# Altium schematic sheet Voltage_Reg_12V.SchDoc: =SheetTitle
size B; SheetTitle: 12V Buck-Boost Reg.; DrawnBy: Samyar Sadat Akhavi; DocumentNumber: 12; SheetNumber: 12; SheetTotal: 19
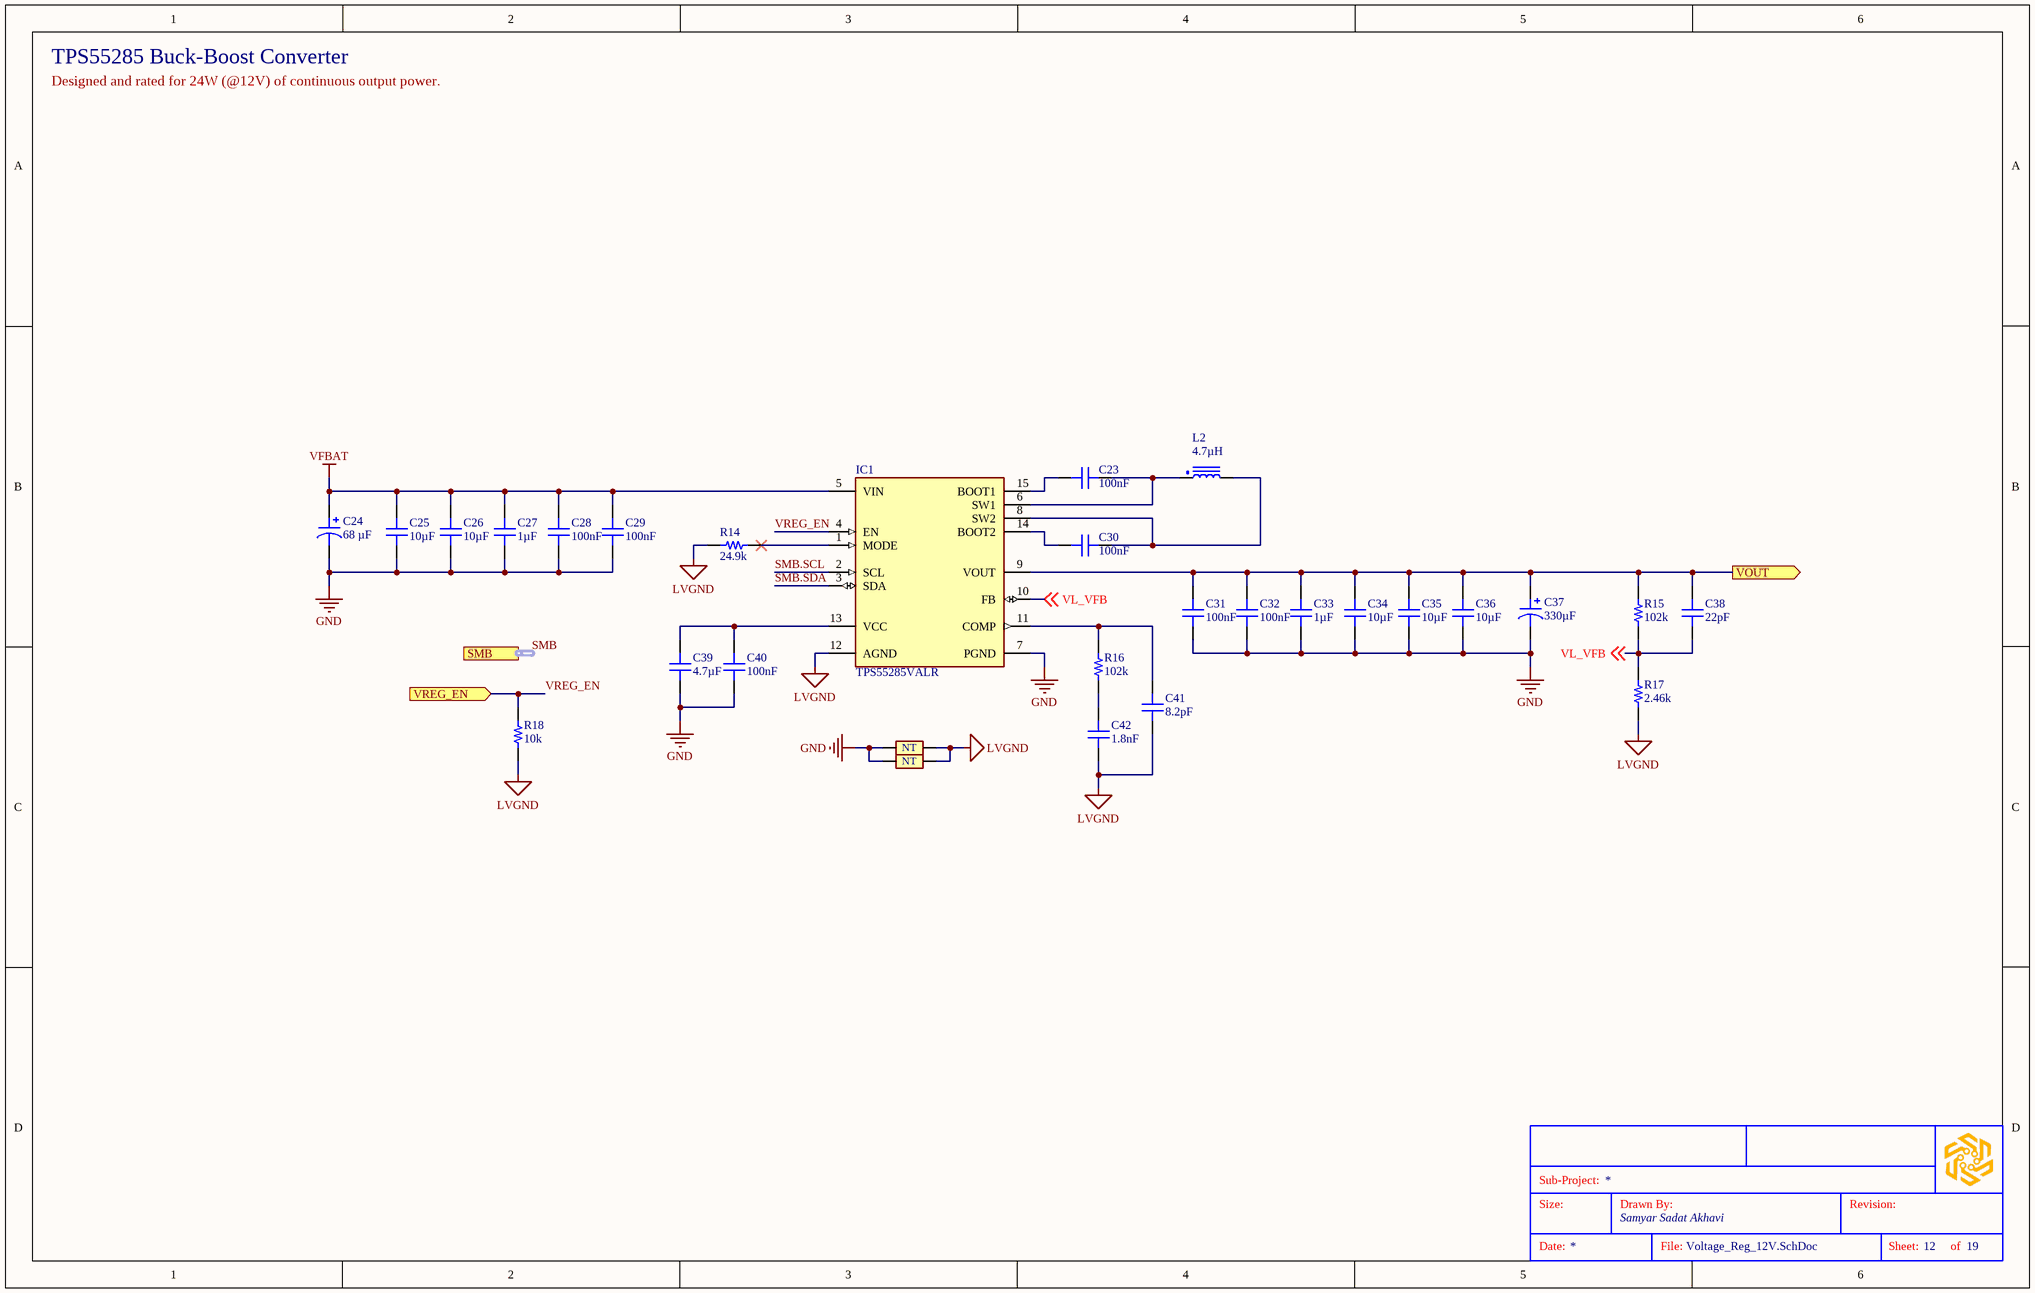
[diagram p0: Voltage_Reg_12V.SchDoc]

## Parts
?  (no value)  (graphical)
C23  100nF  [CAP 0603_1608]
C24  68 µF  [CAP ALSMD 6.6MM H7.7MM]
C25  10µF  [CAP 1206_3216]
C26  10µF  [CAP 1206_3216]
C27  1µF  [CAP 0603_1608]
C28  100nF  [CAP 0603_1608]
C29  100nF  [CAP 0603_1608]
C30  100nF  [CAP 0603_1608]
C31  100nF  [CAP 0603_1608]
C32  100nF  [CAP 0603_1608]
C33  1µF  [CAP 0603_1608]
C34  10µF  [CAP 1206_3216]
C35  10µF  [CAP 1206_3216]
C36  10µF  [CAP 1206_3216]
C37  330µF  [CAPAE830X1250N]
C38  22pF  [CAP 0603_1608]
C39  4.7µF  [CAP 1206_3216]
C40  100nF  [CAP 0603_1608]
C41  8.2pF  [CAP 0603_1608]
C42  1.8nF  [CAP 0603_1608]
IC1  TPS55285VALR  [XTPS55285VALR]
L2  4.7µH  [B82477G4472M000]
NT4  Net Tie  [Net_Tie_Via]  (value not drawn)  (net tie, no BOM)
NT5  Net Tie  [Net_Tie_Via]  (value not drawn)  (net tie, no BOM)
R14  24.9k  [RES 0603_1608]
R15  102k  [RES 0603_1608]
R16  102k  [RES 0603_1608]
R17  2.46k  [RES 0603_1608]
R18  10k  [RES 0603_1608]

## Ports
SMB (harness SMBus, see Voltage_Regulators[1B], INA236_Sensor[3B], TMP112_Sensor[3B], Voltage_Reg_SBC[1B], Voltage_Regulators[5D]), VOUT (out, see Voltage_Regulators[2B]), VREG_EN (in, see Voltage_Regulators[1B])

## Nets
GND: C24.2 C25.1 C26.1 C27.1 C28.1 C29.1 C31.1 C32.1 C33.1 C34.1 C35.1 C36.1 C37.2 C39.1 C40.1 IC1.7(PGND) NT4.1 NT5.1
LVGND: C41.1 C42.1 IC1.12(AGND) NT4.2 NT5.2 R14.1 R17.1 R18.2
VFBAT: C24.1 C25.2 C26.2 C27.2 C28.2 C29.2 IC1.5(VIN)
SMB.SCL: IC1.2(SCL)
SMB.SDA: IC1.3(SDA)
VL_VFB: C38.1 IC1.10(FB) R15.1 R17.2 ; off-sheet VL_VFB
VOUT: C31.2 C32.2 C33.2 C34.2 C35.2 C36.2 C37.1 C38.2 IC1.9(VOUT) R15.2 ; port VOUT
VREG_EN: IC1.4(EN) R18.1 ; port VREG_EN
NetC23_1: C23.1 IC1.6(SW1) L2.1
NetC23_2: C23.2 IC1.15(BOOT1)
NetC30_1: C30.1 IC1.8(SW2) L2.2
NetC30_2: C30.2 IC1.14(BOOT2)
NetC39_2: C39.2 C40.2 IC1.13(VCC)
NetC41_2: C41.2 IC1.11(COMP) R16.2
NetC42_2: C42.2 R16.1
NetIC1_1: IC1.1(MODE) R14.2

## Buses and harness runs
harness SMB = port SMB

## Notes on the sheet
- TPS55285 Buck-Boost Converter
- Designed and rated for 24W (@12V) of continuous output power.
- Sub-Project:
- Size:
- Drawn By:
- Revision:
- Date:
- File:
- Sheet:
- of
- (in symbol GEN-PCBVINT0S3) NT

## Library data of the parts
? = SGR-STDTBSB: STANDARD SCHEMATICS TITLE BLOCK
C23 C28-C32 C40 = GEN-CC100NT10V50KX7R603: GENERIC 0603 MLC CAPACITOR; Tolerance: ±10%; Voltage: 50V; Dielectric: X7R; Part Number: GEN-CC100NT10V50KX7R603; Value: 100nF
C24 = 865080545011: CAP ALUM 68UF 20% 35V SMD; manufacturer: Würth Elektronik; Impedance: 400 mOhms; Lifetime @ Temp.: 2000 Hrs @ 105°C; Polarization: Polar; Ripple Current @ High Frequency: 265 mA @ 100 kHz; Ripple Current @ Low Frequency: 172.25 mA @ 120 Hz; Surface Mount Land Size: 0.260" L x 0.260" W (6.60mm x 6.60mm); Part Number: 865080545011; Applications: General Purpose; Capacitance: 68 µF; componentlink1description: Datasheet; componentlink1url: https://katalog.we-online.de/pbs/datasheet/865080545011.pdf; componentlink2description: DigiKey Link; componentlink2url: https://www.digikey.com/en/products/detail/würth-elektronik/865080545011/5728105; Device Package: Radial, Can - SMD; Height - Seated (Max): 0.303" (7.70mm); lastupdated: 4/5/2026 8:54:40 PM; Lifecycle Status: Active; Minimum Order: 1; Mounting Type: Surface Mount; Operating Temperature: -55°C ~ 105°C; Package / Case: Radial, Can - SMD; packaging: TapeAndReel; partid: 27323; Part Status: Active; price: 0.17; series: WCAP-ASLI; Size / Dimension: 0.248" Dia (6.30mm); Supplier 1: DigiKey; Supplier Part Number 1: 732-8510-1-ND; Tolerance: ±20%; value: 68 µF; Voltage - Rated: 35 V
C25 C26 C34-C36 = GEN-CC10UT10V25KX7R1206: GENERIC 1206 MLC CAPACITOR; Tolerance: ±10%; Voltage: 25V; Dielectric: X7R; Part Number: GEN-CC10UT10V25KX7R1206; Value: 10µF
C27 C33 = GEN-CC1UT10V25KX7R603: GENERIC 0603 MLC CAPACITOR; Tolerance: ±10%; Voltage: 25V; Dielectric: X7R; Part Number: GEN-CC1UT10V25KX7R603; Value: 1µF
C37 = A768KS337M1ELAS019: CAP ALUM POLY 330UF 20% 25V SMD; Manufacturer: KEMET; ESR: 19mOhm; Lifetime Temp: 2000 Hrs @ 125°C; Part Number: A768KS337M1ELAS019; Value: 330µF; Tolerance: ±20%; Voltage: 25V; Supplier 1: DigiKey; Supplier Part Number 1: 399-A768KS337M1ELAS019CT-ND
C38 = GEN-CC22PT10V16KX7R603: GENERIC 0603 MLC CAPACITOR; Tolerance: ±10%; Voltage: 16V; Dielectric: X7R; Part Number: GEN-CC22PT10V16KX7R603; Value: 22pF
C39 = GEN-CC4U7T10V25KX7R1206: GENERIC 1206 MLC CAPACITOR; Tolerance: ±10%; Voltage: 25V; Dielectric: X7R; Part Number: GEN-CC4U7T10V25KX7R1206; Value: 4.7µF
C41 = GEN-CC8P2TCV50KC0G603: GENERIC 0603 MLC CAPACITOR; Tolerance: ±0.25pF; Voltage: 50V; Dielectric: C0G; Part Number: GEN-CC8P2TCV50KC0G603; Value: 8.2pF
C42 = GEN-CC1N8T5V50KC0G603: GENERIC 0603 MLC CAPACITOR; Tolerance: ±5%; Voltage: 50V; Dielectric: C0G; Part Number: GEN-CC1N8T5V50KC0G603; Value: 1.8nF
IC1 = TPS55285VALR: 22V 8A BUCK-BOOST CONVERTER WITH; Manufacturer: Texas Instruments; Part Number: TPS55285VALR; Supplier 1: DigiKey; Supplier Part Number 1: 296-TPS55285VALRCT-ND
L2 = B82477G4472M000: FIXED IND 4.7UH 6.8A 14 MOHM SMD; Manufacturer: TDK; Tolerance: ±20%; Saturation Current: 8.6A; DC Resistance: 14mOhm; Part Number: B82477G4472M000; Value: 4.7µH; Current Rating: 6.8A; Supplier 1: DigiKey; Supplier Part Number 1: 495-1821-1-ND
NT4 NT5 = GEN-PCBVINT0S3: VIA STYLE CIRCULAR NET TIE; Part Number: GEN-PCBVINT0S3; Size Variant: 0.3mm
R14 = GEN-CRR24K9T1P8603: GENERIC 0603 CHIP RESISTOR; Tolerance: ±1%; Power: 0.125W; Part Number: GEN-CRR24K9T1P8603; Value: 24.9k
R15 R16 = GEN-CRR102KT1P8603: GENERIC 0603 CHIP RESISTOR; Tolerance: ±1%; Power: 0.125W; Part Number: GEN-CRR102KT1P8603; Value: 102k
R17 = GEN-CRR2K46T1P8603: GENERIC 0603 CHIP RESISTOR; Tolerance: ±1%; Power: 0.125W; Part Number: GEN-CRR2K46T1P8603; Value: 2.46k
R18 = GEN-CRR10KT1P8603: GENERIC 0603 CHIP RESISTOR; Tolerance: ±1%; Power: 0.125W; Part Number: GEN-CRR10KT1P8603; Value: 10k